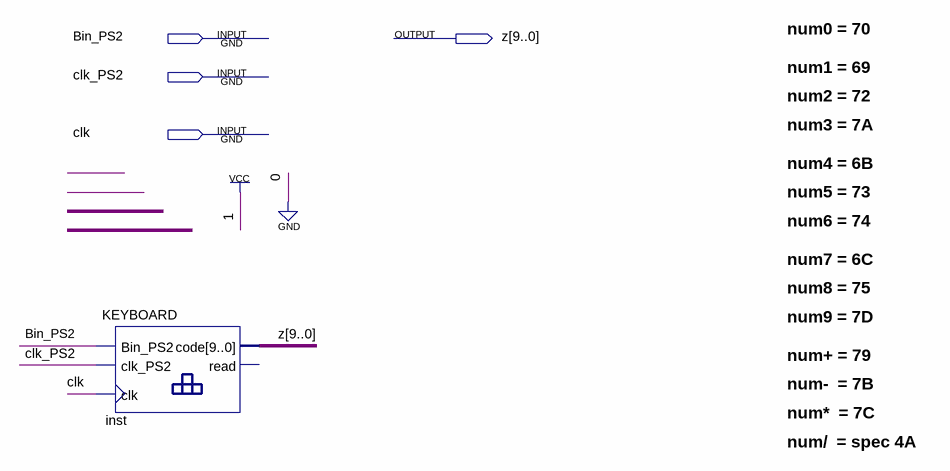
[diagram p0: schematic sheet]
// Quartus schematic main_1.bdf as structural Verilog: 1 symbols, 4 pins
module main_1 (
  input  Bin_PS2,
  input  clk_PS2,
  input  clk,
  output [9:0] z
);

  KEYBOARD inst (.Bin_PS2(Bin_PS2), .clk_PS2(clk_PS2), .clk(clk), .code(z));  // open: read

  // Notes on the sheet:
  //   num0 = 70
  //   num1 = 69
  //   num2 = 72
  //   num3 = 7A
  //   num4 = 6B
  //   num5 = 73
  //   num6 = 74
  //   num7 = 6C
  //   num8 = 75
  //   num9 = 7D
  //   num+ = 79
  //   num-  = 7B
  //   num*  = 7C
  //   num/  = spec 4A
endmodule
